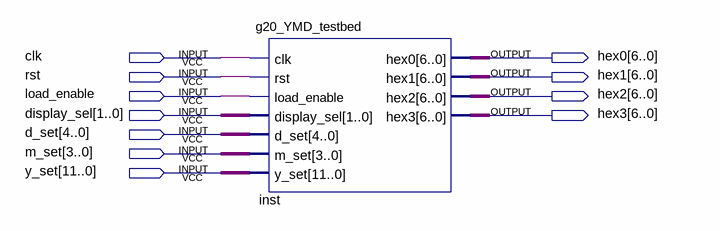
[diagram p0: schematic sheet]
// Quartus schematic g20_YMD_testbed.bdf as structural Verilog: 1 symbols, 11 pins
module g20_YMD_testbed (
  input  clk,
  input  rst,
  input  load_enable,
  input  [1:0] display_sel,
  input  [4:0] d_set,
  input  [3:0] m_set,
  input  [11:0] y_set,
  output [6:0] hex0,
  output [6:0] hex1,
  output [6:0] hex2,
  output [6:0] hex3
);

  g20_YMD_testbed inst (
    .clk(clk), .rst(rst), .load_enable(load_enable), .display_sel(display_sel), .d_set(d_set), .m_set(m_set),
    .y_set(y_set), .hex0(hex0), .hex1(hex1), .hex2(hex2), .hex3(hex3));
endmodule
